# EAGLE design nixie-tube-clock_mainboard (EAGLE 9.6.2)
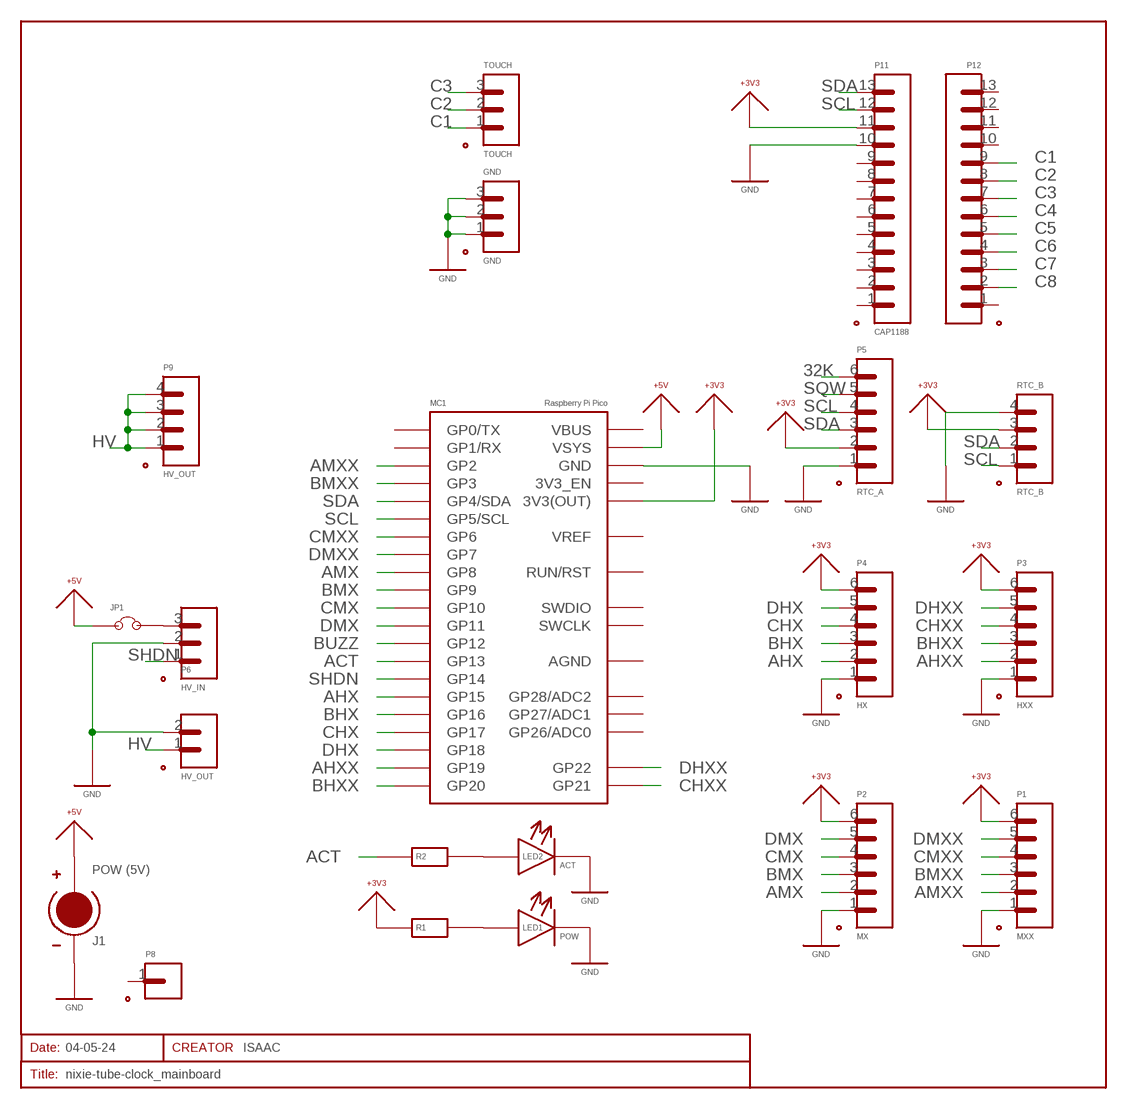
[diagram p0: schematic, sheet 1]

## Parts
CREATOR  ISAAC  INFO_T  [INFO_T]
GND  GND  PORT_3-PIN_XH2.54  [XH2.54_3-PIN]
J1  POW (5V)  DC_POWER_CENTER-POS_XH2.54  [XH2.54_2-PIN]
JP1  JUMPER_2-WAY_HEADER  [HEADER_2-PIN_JUMPER]
LED1  POW  LED_3MM  [LED_3MM]
LED2  ACT  LED_3MM  [LED_3MM]
MC1  RASPBERRY-PI-PICO_THT  [RASPBERRY-PI-PICO_THT]
P1  MXX  PORT_6-PIN_XH2.54  [XH2.54_6-PIN]
P2  MX  PORT_6-PIN_XH2.54  [XH2.54_6-PIN]
P3  HXX  PORT_6-PIN_XH2.54  [XH2.54_6-PIN]
P4  HX  PORT_6-PIN_XH2.54  [XH2.54_6-PIN]
P5  RTC_A  PORT_6-PIN_HEADER  [HEADER_6-PIN]
P6  HV_OUT  PORT_2-PIN_HEADER  [HEADER_2-PIN]
P7  HV_IN  PORT_3-PIN_HEADER  [HEADER_3-PIN]
P8  PORT_1-PIN_HEADER  [HEADER_1-PIN]
P9  HV_OUT  PORT_4-PIN_XH2.54  [XH2.54_4-PIN]
P11  CAP1188  PORT_13-PIN_HEADER  [HEADER_13-PIN]
P12  PORT_13-PIN_HEADER  [HEADER_13-PIN]
R1  RESISTOR  [RESISTOR_10.16MM]
R2  RESISTOR  [RESISTOR_10.16MM]
RTC_B  RTC_B  PORT_4-PIN_XH2.54  [XH2.54_4-PIN]
SCHEMATIC1  04-05-24  SHEET  [SHEET]
TOUCH  TOUCH  PORT_3-PIN_XH2.54  [XH2.54_3-PIN]

## Nets
32K: P5.6
+3V3: MC1.36(3V3(OUT)) P1.6 P2.6 P3.6 P4.6 P5.2 P11.11 R1.1 RTC_B.3
+5V: J1.2(+) JP1.1 MC1.39(VSYS)
ACT: MC1.17(GP13) R2.1
AHX: MC1.20(GP15) P4.2
AHXX: MC1.25(GP19) P3.2
AMX: MC1.11(GP8) P2.2
AMXX: MC1.4(GP2) P1.2
BHX: MC1.21(GP16) P4.3
BHXX: MC1.26(GP20) P3.3
BMX: MC1.12(GP9) P2.3
BMXX: MC1.5(GP3) P1.3
BUZZ: MC1.16(GP12)
C1: P12.9 TOUCH.1
C2: P12.8 TOUCH.2
C3: P12.7 TOUCH.3
C4: P12.6
C5: P12.5
C6: P12.4
C7: P12.3
C8: P12.2
CHX: MC1.22(GP17) P4.4
CHXX: MC1.27(GP21) P3.4
CMX: MC1.14(GP10) P2.4
CMXX: MC1.9(GP6) P1.4
DHX: MC1.24(GP18) P4.5
DHXX: MC1.29(GP22) P3.5
DMX: MC1.15(GP11) P2.5
DMXX: MC1.10(GP7) P1.5
GND: GND.1 GND.2 GND.3 J1.1(GND) LED1.- LED2.- MC1.3(GND) MC1.8(GND) MC1.13(GND) MC1.18(GND) MC1.23(GND) MC1.28(GND) MC1.38(GND) MC1.D_GND(GND) P1.1 P2.1 P3.1 P4.1 P5.1 P6.2 P7.2 P11.10 RTC_B.4
HV: P6.1 P9.1 P9.2 P9.3 P9.4
N$1: LED1.+ R1.2
N$2: LED2.+ R2.2
N$9: JP1.2 P7.3
SCL: MC1.7(GP5/SCL) P5.4 P11.12 RTC_B.1
SDA: MC1.6(GP4/SDA) P5.3 P11.13 RTC_B.2
SHDN: MC1.19(GP14) P7.1
SQW: P5.5
Unconnected: MC1.1(GP0/TX) MC1.2(GP1/RX) MC1.30(RUN/RST) MC1.31(GP26/ADC0) MC1.32(GP27/ADC1) MC1.34(GP28/ADC2) MC1.35(VREF) MC1.37(3V3_EN) MC1.40(VBUS) MC1.SWCLK MC1.SWDIO P8.1 P11.1 P11.2 P11.3 P11.4 P11.5 P11.6 P11.7 P11.8 P11.9 P12.1 P12.10 P12.11 P12.12 P12.13

## Power pins joined to a net without a drawn wire
AGND: MC1.33(AGND)

## Library data of the parts
CREATOR = myLibrary:INFO
GND P7 TOUCH = myLibrary:PORT_3-PIN
J1 = myLibrary:DC_POWER_CENTER-POS
JP1 = myLibrary:JUMPER_2-WAY
LED1 LED2 = myLibrary:LED
MC1 = myLibrary:RASPBERRY-PI-PICO
P1-P5 = myLibrary:PORT_6-PIN
P6 = myLibrary:PORT_2-PIN
P8 = myLibrary:PORT_1-PIN
P9 RTC_B = myLibrary:PORT_4-PIN
P11 P12 = myLibrary:PORT_13-PIN
R1 R2 = myLibrary:RESISTOR
SCHEMATIC1 = myLibrary:SHEET

## Board
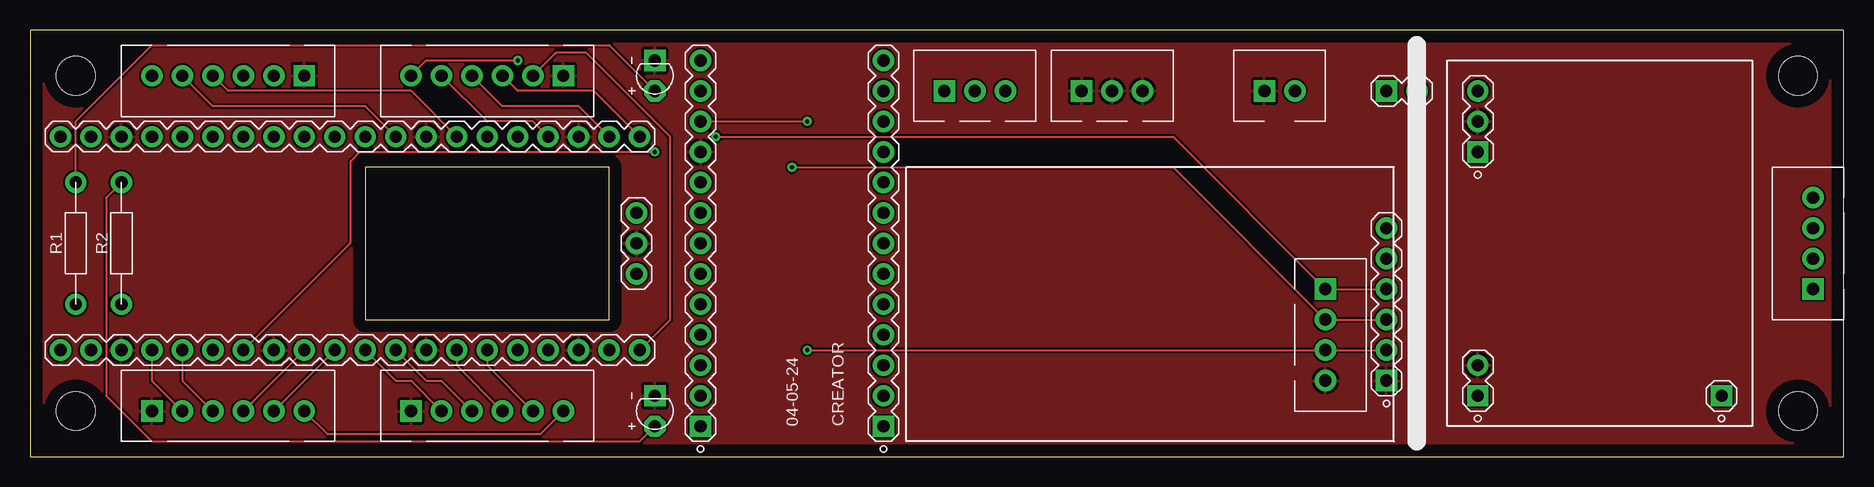
[diagram p1: board, top side]
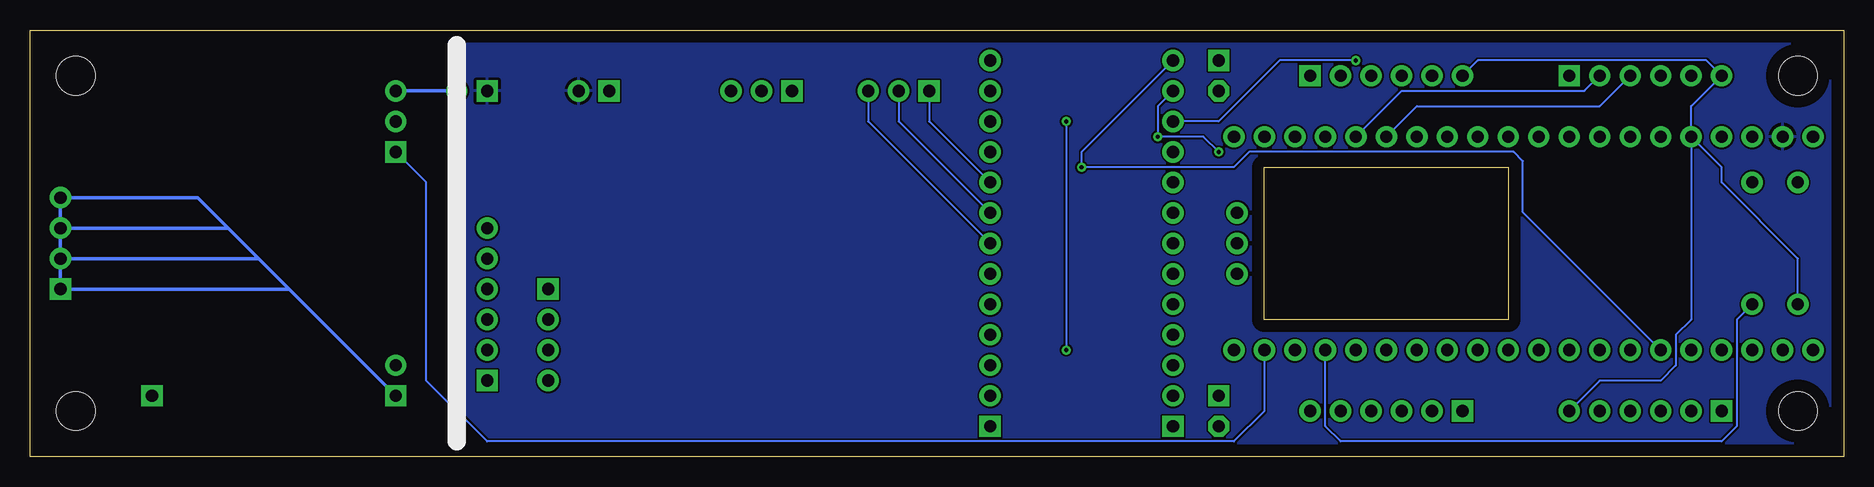
[diagram p2: board, bottom side, seen from below]

Size 151.13 x 35.56 mm. Coordinates in mm from the lower left corner, seen from the top.
Outline: 0,0 151.13,0 151.13,35.56 0,35.56 0,0
Copper layers (1*16): Top 0.035mm / dielectric 1.5mm / Bottom 0.035mm
Design rules "default": minimum track width 6mil, minimum drill 0.35mm, track to track 6mil, track to pad 6mil, pad to pad 6mil, via to via 6mil, smd to smd 6mil, copper to edge 40mil, drill to drill 6mil, minimum pad ring 10mil, minimum via ring 8mil, stop-mask expansion 4mil, vias tented up to drill 0mil, thermal gap 10mil
Holes 3.2 mm at 3.81,31.75 3.81,3.81 147.32,3.81 147.32,31.75
bRestrict: area 27.9,11.4 to 48.3,24.1

### Footprints (pad centres in the part's own frame; a part is rotated, then mirrored left to right if it is on the bottom)
XH2.54_3-PIN = drill 1.016 pad 1.778 square: 1 -2.54,0 | drill 1.016 pad 1.778: 2 0,0; 3 2.54,0
XH2.54_2-PIN = drill 1.016 pad 1.778 square: 1 -1.27,0 | drill 1.016 pad 1.778: 2 1.27,0
HEADER_2-PIN_JUMPER = drill 1.016 pad 1.778 square: 1 0,0 | drill 1.016 pad 1.778: 2 0,2.54
LED_3MM = drill 1.016 pad 1.778 octagon: + -1.27,0 | drill 1.016 pad 1.778 square: - 1.27,0
RASPBERRY-PI-PICO_THT = drill 1.016 pad 1.778: 1 -8.89,24.13; 2 -8.89,21.59; 3 -8.89,19.05; 4 -8.89,16.51; 5 -8.89,13.97; 6 -8.89,11.43; 7 -8.89,8.89; 8 -8.89,6.35; 9 -8.89,3.81; 10 -8.89,1.27; 11 -8.89,-1.27; 12 -8.89,-3.81; 13 -8.89,-6.35; 14 -8.89,-8.89; 15 -8.89,-11.43; 16 -8.89,-13.97; 17 -8.89,-16.51; 18 -8.89,-19.05; 19 -8.89,-21.59; 20 -8.89,-24.13; 21 8.89,-24.13; 22 8.89,-21.59; 23 8.89,-19.05; 24 8.89,-16.51; 25 8.89,-13.97; 26 8.89,-11.43; 27 8.89,-8.89; 28 8.89,-6.35; 29 8.89,-3.81; 30 8.89,-1.27; 31 8.89,1.27; 32 8.89,3.81; 33 8.89,6.35; 34 8.89,8.89; 35 8.89,11.43; 36 8.89,13.97; 37 8.89,16.51; 38 8.89,19.05; 39 8.89,21.59; 40 8.89,24.13; D_GND 0,-23.876; SWCLK -2.54,-23.876; SWDIO 2.54,-23.876
XH2.54_6-PIN = drill 1.016 pad 1.778 square: 1 -6.35,0 | drill 1.016 pad 1.778: 2 -3.81,0; 3 -1.27,0; 4 1.27,0; 5 3.81,0; 6 6.35,0
HEADER_6-PIN = drill 1.016 pad 1.778 square: 1 0,0 | drill 1.016 pad 1.778: 2 0,2.54; 3 0,5.08; 4 0,7.62; 5 0,10.16; 6 0,12.7
HEADER_2-PIN = drill 1.016 pad 1.778 square: 1 0,0 | drill 1.016 pad 1.778: 2 0,2.54
HEADER_3-PIN = drill 1.016 pad 1.778 square: 1 0,0 | drill 1.016 pad 1.778: 2 0,2.54; 3 0,5.08
HEADER_1-PIN = drill 1.016 pad 1.778 square: 1 0,0
XH2.54_4-PIN = drill 1.016 pad 1.778 square: 1 -3.81,0 | drill 1.016 pad 1.778: 2 -1.27,0; 3 1.27,0; 4 3.81,0
HEADER_13-PIN = drill 1.016 pad 1.778 square: 1 0,0 | drill 1.016 pad 1.778: 2 0,2.54; 3 0,5.08; 4 0,7.62; 5 0,10.16; 6 0,12.7; 7 0,15.24; 8 0,17.78; 9 0,20.32; 10 0,22.86; 11 0,25.4; 12 0,27.94; 13 0,30.48
RESISTOR_10.16MM = drill 1.016 pad 1.778: 1 -5.08,0; 2 5.08,0

### Placement (x,y rotation side)
CREATOR  68.58,2.54 90 top
GND  90.17,30.48 0 top
J1  104.14,30.48 0 top
JP1  113.03,30.48 270 top
LED1  52.07,31.75 90 top
LED2  52.07,3.81 90 top
MC1  26.67,17.78 90 top
P1  16.51,3.81 0 top
P2  38.1,3.81 0 top
P3  16.51,31.75 180 top
P4  38.1,31.75 180 top
P5  113.03,6.35 0 top
P6  120.65,5.08 0 top
P7  120.65,25.4 0 top
P8  140.97,5.08 0 top
P9  148.59,17.78 90 top
P11  55.88,2.54 0 top
P12  71.12,2.54 0 top
R1  3.81,17.78 90 top
R2  7.62,17.78 90 top
RTC_B  107.95,10.16 270 top
SCHEMATIC1  60.96,2.54 90 top
TOUCH  78.74,30.48 0 top

### Tracks (layer width: path | path; a pad name or v marks a point on that pad's centre or on a via)
+3V3  (via drill 0.35)
  Top 0.152: P1.6 24.77,1.91 42.55,1.91 P2.6 | P4.6 33.02,33.02 v40.64,33.02 | P11.11 v64.77,27.94 | v64.77,8.89 RTC_B.3 P5.2
  Bottom 0.152: R1.1 3.81,16.51 10.16,22.86 10.16,24.13 MC1.36 | MC1.36 12.7,29.21 P3.6 11.43,33.02 30.48,33.02 P4.6 | P1.6 20.32,6.35 15.24,6.35 13.97,7.62 13.97,10.16 12.7,11.43 MC1.36 | v40.64,33.02 46.99,33.02 52.07,27.94 P11.11 | v64.77,27.94 v64.77,8.89
+5V
  pour Bottom: -2.54,38.1 -2.54,-2.54 115.57,-2.54 115.57,38.1
ACT
  Bottom 0.152: R2.1 8.89,11.43 8.89,2.54 10.16,1.27 41.91,1.27 43.18,2.54 MC1.17
AHX
  Top 0.152: MC1.20 53.34,11.43 53.34,26.67 46.35,33.66 43.81,33.66 P4.2
AHXX
  Bottom 0.152: MC1.25 36.83,30.48 21.59,30.48 P3.2
AMX
  Top 0.152: MC1.11 30.48,6.35 31.75,6.35 P2.2
AMXX
  Top 0.152: MC1.4 10.16,6.35 P1.2
BHX
  Top 0.152: P4.3 40.64,30.48 46.99,30.48 MC1.21
BHXX
  Bottom 0.152: MC1.26 35.56,29.21 20.32,29.21 P3.3
BMX
  Top 0.152: MC1.12 33.02,6.35 34.29,6.35 P2.3
BMXX
  Top 0.152: MC1.5 12.7,6.35 P1.3
C1
  Bottom 0.152: TOUCH.1 76.2,27.94 P12.9
C2
  Bottom 0.152: TOUCH.2 78.74,27.94 P12.8
C3
  Bottom 0.152: TOUCH.3 81.28,27.94 P12.7
CHX
  Top 0.152: MC1.22 45.72,29.21 39.37,29.21 P4.4
CHXX
  Top 0.152: MC1.27 31.75,30.48 16.51,30.48 P3.4
CMX
  Top 0.152: MC1.14 35.56,7.62 P2.4
CMXX
  Top 0.152: MC1.9 P1.4
DHX
  Top 0.152: MC1.24 41.91,27.94 38.1,27.94 P4.5
DHXX
  Top 0.152: MC1.29 27.94,29.21 15.24,29.21 P3.5
DMX
  Top 0.152: MC1.15 38.1,7.62 P2.5
DMXX
  Top 0.152: MC1.10 P1.5
GND
  pour Top: -1.27,36.83 -1.27,-1.27 152.4,-1.27 152.4,36.83
HV
  Bottom 0.305: P6.1 129.54,13.97 | 129.54,13.97 132.08,16.51 | 132.08,16.51 134.62,19.05 | P9.3 134.62,19.05 | 134.62,19.05 137.16,21.59 P9.4 P9.3 | P9.3 P9.2 | P9.2 P9.1 129.54,13.97 | P9.2 132.08,16.51
N$1
  Top 0.152: R1.2 3.81,27.94 10.16,34.29 48.26,34.29 LED1.+
N$2
  Top 0.152: R2.2 6.35,21.59 6.35,5.08 10.16,1.27 50.8,1.27 LED2.+
N$9
  Bottom 0.305: JP1.2 P7.3
SCL  (via drill 0.35)
  Top 0.152: MC1.7 26.72,17.83 26.72,24.64 27.49,25.4 v52.07,25.4 | v57.15,26.67 95.25,26.67 RTC_B.1 P5.4
  Bottom 0.152: v52.07,25.4 53.34,26.67 v57.15,26.67 57.15,29.21 P11.12
SDA  (via drill 0.35)
  Top 0.152: v63.5,24.13 95.25,24.13 RTC_B.2 P5.3
  Bottom 0.152: MC1.6 26.72,20.37 26.72,24.64 27.49,25.4 49.53,25.4 50.8,24.13 v63.5,24.13 63.5,25.4 P11.13
SHDN
  Bottom 0.152: MC1.19 48.26,3.81 50.8,1.27 113.03,1.27 118.11,6.35 118.11,22.86 P7.1